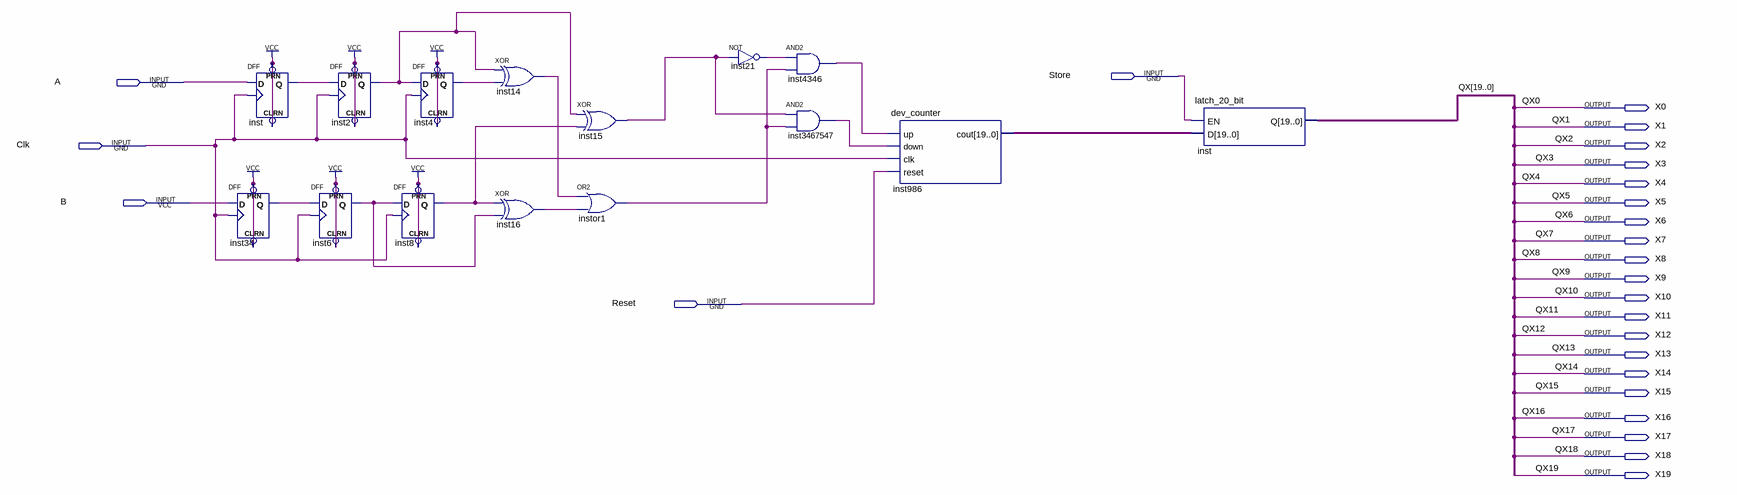
[diagram p0: schematic sheet]
// Quartus schematic enc_count_test.bdf as structural Verilog: 15 symbols, 25 pins
module enc_count_test (
  input  Store,
  input  A,
  input  Clk,
  input  B,
  input  Reset,
  output X0,
  output X1,
  output X2,
  output X3,
  output X4,
  output X5,
  output X6,
  output X7,
  output X8,
  output X9,
  output X10,
  output X11,
  output X12,
  output X13,
  output X14,
  output X15,
  output X16,
  output X17,
  output X18,
  output X19
);

  wire inst2_q, inst4_q, inst6_q, inst8_q, inst14_out, inst15_out, inst16_out, inst21_out, inst34_q,
       inst4346_out, inst3467547_out, inst_q, instor1_out;
  wire [19:0] inst986_cout;

  DFF inst34 (.CLRN(1'b1), .CLK(Clk), .D(B), .PRN(1'b1), .Q(inst34_q));
  DFF inst (.CLRN(1'b1), .CLK(Clk), .D(A), .PRN(1'b1), .Q(inst_q));
  DFF inst2 (.CLRN(1'b1), .CLK(Clk), .D(inst_q), .PRN(1'b1), .Q(inst2_q));
  DFF inst6 (.CLRN(1'b1), .CLK(Clk), .D(inst34_q), .PRN(1'b1), .Q(inst6_q));
  DFF inst4 (.CLRN(1'b1), .CLK(Clk), .D(inst2_q), .PRN(1'b1), .Q(inst4_q));
  DFF inst8 (.CLRN(1'b1), .CLK(Clk), .D(inst6_q), .PRN(1'b1), .Q(inst8_q));
  xor inst14 (inst14_out, inst2_q, inst4_q);
  xor inst16 (inst16_out, inst8_q, inst6_q);
  xor inst15 (inst15_out, inst2_q, inst8_q);
  or instor1 (instor1_out, inst14_out, inst16_out);
  not inst21 (inst21_out, inst15_out);
  and inst4346 (inst4346_out, inst21_out, instor1_out);
  and inst3467547 (inst3467547_out, inst15_out, instor1_out);
  dev_counter inst986 (.up(inst4346_out), .down(inst3467547_out), .clk(Clk), .reset(Reset), .cout(inst986_cout));
  latch_20_bit inst_dup2 (
    .EN(Store), .D(inst986_cout),
    .Q({X19, X18, X17, X16, X15, X14, X13, X12, X11, X10, X9, X8, X7, X6, X5, X4, X3, X2, X1, X0}));

  // Other names for the same wires on the sheet: QX[19:0] = {X19, X18, X17, X16, X15, X14, X13, X12, X11, X10, X9, X8, X7, X6, X5, X4, X3, X2, X1, X0};
  //   QX0 = X0; QX1 = X1; QX2 = X2; QX3 = X3; QX4 = X4; QX5 = X5; QX6 = X6; QX7 = X7; QX8 = X8; QX9 = X9; QX10 = X10;
  //   QX11 = X11; QX12 = X12; QX13 = X13; QX14 = X14; QX15 = X15; QX16 = X16; QX17 = X17; QX18 = X18; QX19 = X19
endmodule
